# EAGLE design ws2812B (EAGLE 7.2.0)
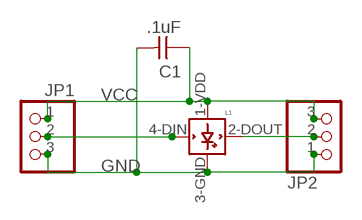
[diagram p0: schematic, sheet 1]

## Parts
C1  .1uF  CAP-UNPOLARIZEDFAB  [C1206FAB]
JP1  PINHD-1X3CB  [1X03-CLEANBIG]
JP2  PINHD-1X3CB  [1X03-CLEANBIG]
L1  WS2812B  [WS2812B]

## Nets
GND: C1.2 JP1.3 JP2.1 L1.3-GND(GND)
N$1: JP2.2 L1.2-DOUT(DOUT)
N$3: JP1.2 L1.4-DIN(DIN)
VCC: C1.1 JP1.1 JP2.3 L1.1-VDD(VDD)

## Library data of the parts
C1 = fab:CAP-UNPOLARIZED
JP1 JP2 = adafruit:PINHD-1X3: PIN HEADER
L1 = adafruit:WS2812B

## Board
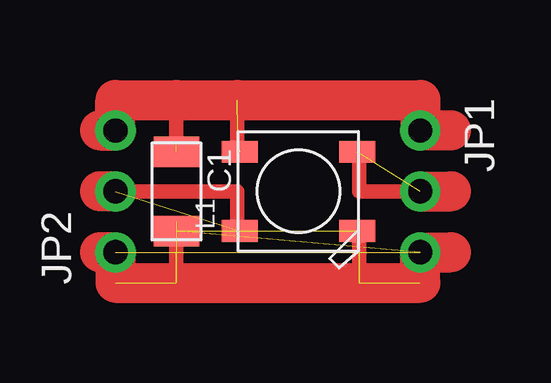
[diagram p1: board, top side]

No outline drawn. Coordinates in mm, seen from the top.
Copper layers (1*16): Top 0.035mm / dielectric 1.5mm / Bottom 0.035mm
Design rules "default": minimum track width 10mil, minimum drill 24mil, track to track 8mil, track to pad 8mil, pad to pad 8mil, via to via 8mil, smd to smd 8mil, copper to edge 40mil, drill to drill 8mil, minimum pad ring 10mil, minimum via ring 8mil, stop-mask expansion 4mil, vias tented up to drill 0mil, thermal gap 10mil

### Footprints (pad centres in the part's own frame; a part is rotated, then mirrored left to right if it is on the bottom)
C1206FAB = smd 1.27 x 1.905: 1 -1.651,0; 2 1.651,0
1X03-CLEANBIG = drill 1.016 pad 1.676: 1 -2.54,0; 2 0,0; 3 2.54,0
WS2812B = smd 1.5 x 0.9: 1-VDD 2.45,-1.65; 2-DOUT 2.45,1.65; 3-GND -2.45,1.65; 4-DIN -2.45,-1.65

### Placement (x,y rotation side)
C1  4.45,5.08 270 top
JP1  14.61,5.08 270 top
JP2  1.91,5.08 90 top
L1  9.53,5.08 180 top

### Tracks (layer width: path | path; a pad name or v marks a point on that pad's centre or on a via)
GND  (11 unrouted)
  Top 0.61: 12.06,3.17 12.06,1.27
  Top 1.676: 1.27,2.54 JP2.1 1.91,1.27 12.06,1.27 14.61,1.27 JP1.3 15.88,2.54
N$1  (1 unrouted)
  Top 0.61: JP2.2 6.99,5.08 6.99,3.81
  Top 1.676: JP2.2 1.27,5.08
N$2
  Top 0.61: 4.45,3.17 4.45,1.91
N$3  (1 unrouted)
  Top 0.61: 12.06,6.35 12.06,5.08 JP1.2
  Top 1.676: JP1.2 15.88,5.08
VCC  (5 unrouted)
  Top 0.61: 4.45,6.99 4.45,8.89 | 6.99,8.89 6.99,6.99
  Top 1.676: 1.27,7.62 JP2.3 1.91,8.89 4.45,8.89 6.99,8.89 14.61,8.89 JP1.1 15.88,7.62